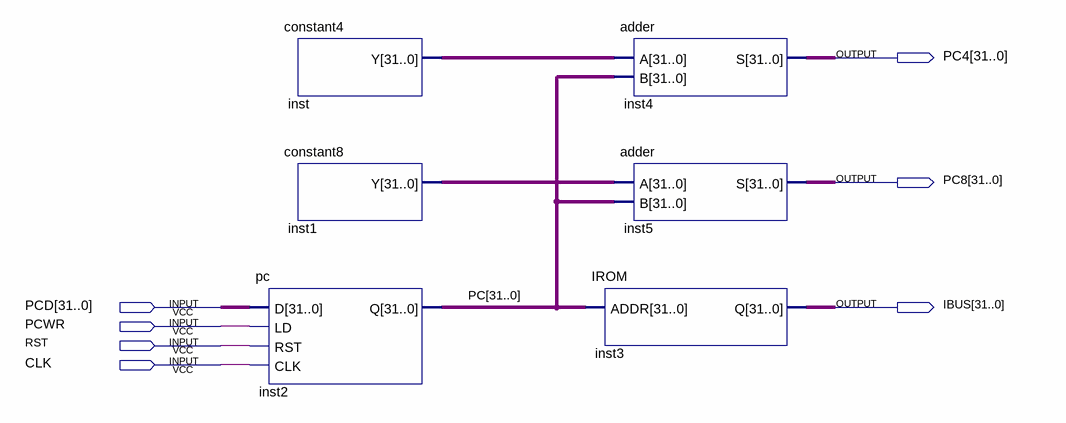
[diagram p0: schematic sheet]
// Quartus schematic fetch.bdf as structural Verilog: 6 symbols, 7 pins
module fetch (
  input  [31:0] PCD,
  input  PCWR,
  input  RST,
  input  CLK,
  output [31:0] PC4,
  output [31:0] PC8,
  output [31:0] IBUS
);

  wire [31:0] inst1_y, inst_y, PC;

  constant4 inst (.Y(inst_y));
  constant8 inst1 (.Y(inst1_y));
  pc inst2 (.D(PCD), .LD(PCWR), .RST(RST), .CLK(CLK), .Q(PC));
  adder inst4 (.A(inst_y), .B(PC), .S(PC4));
  adder inst5 (.A(inst1_y), .B(PC), .S(PC8));
  IROM inst3 (.ADDR(PC), .Q(IBUS));
endmodule
